# EAGLE design XBee7 (EAGLE 6.4)
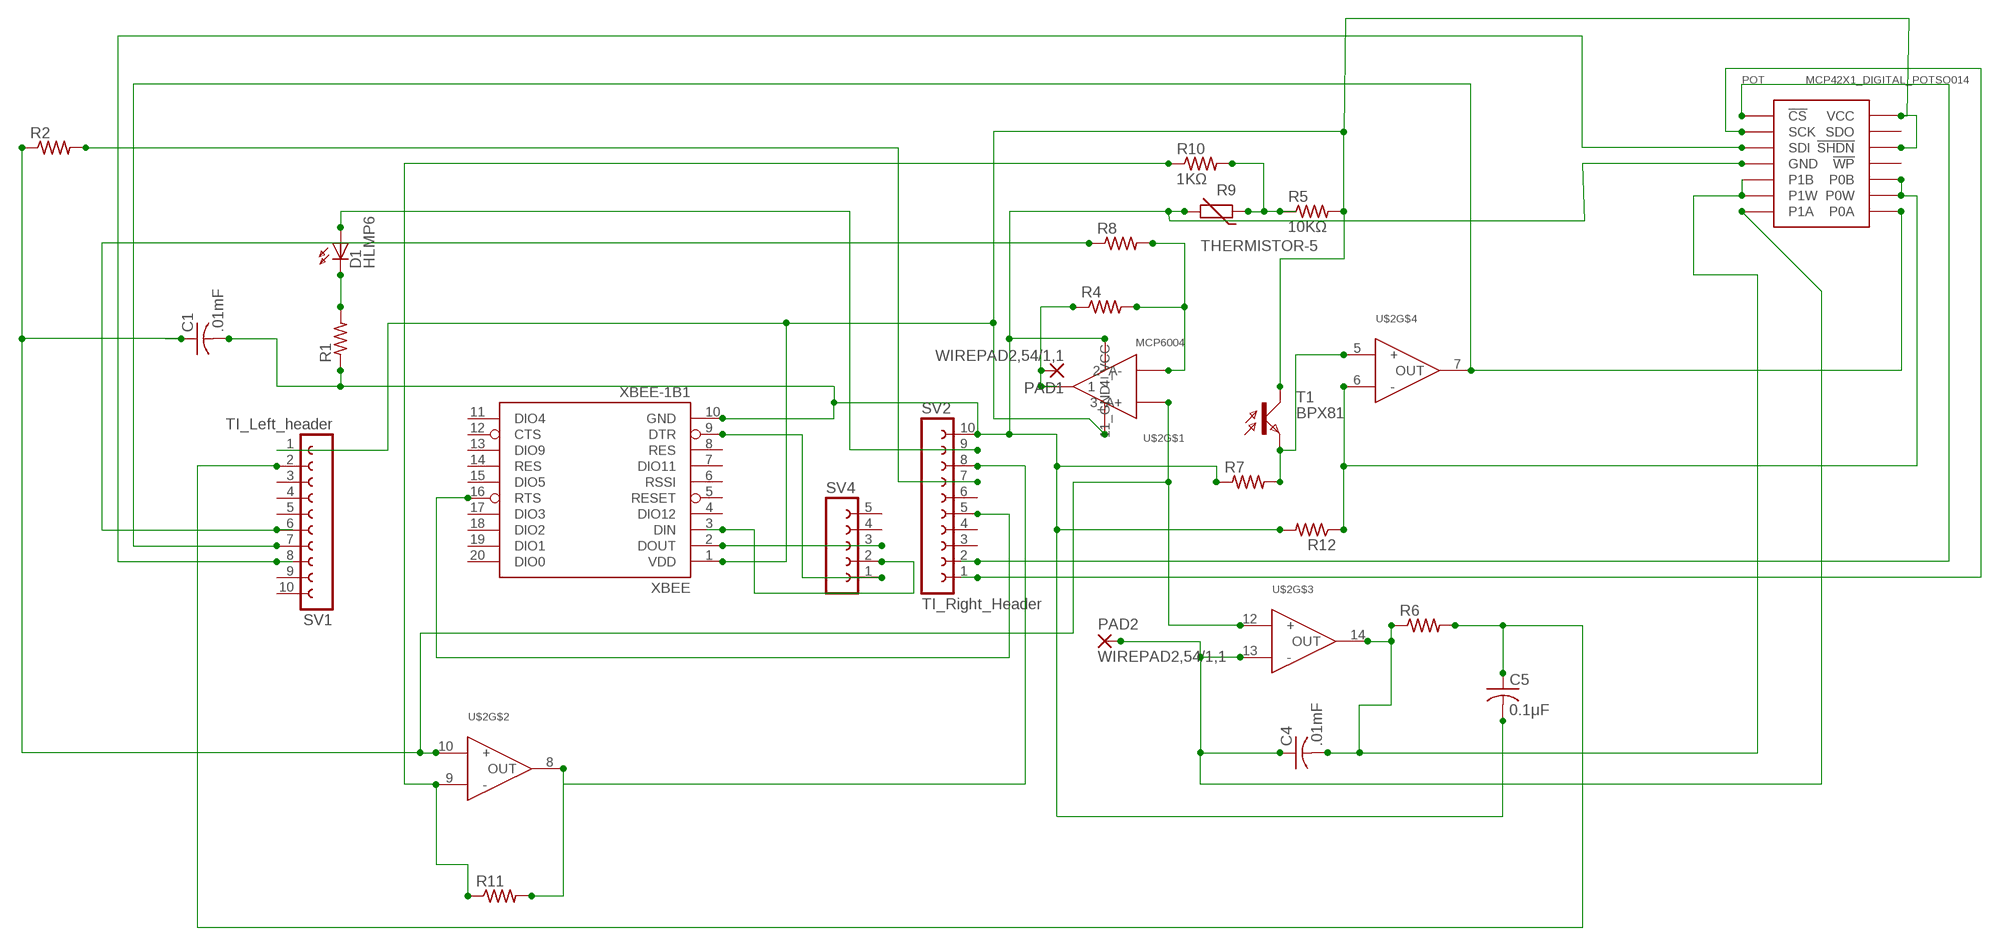
[diagram p0: schematic, sheet 1]

## Parts
C1  .01mF  C-USC0603  [C0603]
C4  .01mF  C-USC0603  [C0603]
C5  0.1μF  C-USC0603  [C0603]
D1  HLMP6  [HLMP6]
PAD1  WIREPAD2,54/1,1  [2,54/1,1]
PAD2  WIREPAD2,54/1,1  [2,54/1,1]
POT  MCP42X1_DIGITAL_POTSO014  [SO014]
R1  R-US_R0603  [R0603]
R2  R-US_R0603  [R0603]
R4  R-US_R0603  [R0603]
R5  10KΩ  R-US_R0603  [R0603]
R6  R-US_R0603  [R0603]
R7  R-US_R0603  [R0603]
R8  R-US_R0603  [R0603]
R9  THERMISTOR-5  [R-5]
R10  1KΩ  R-US_R0603  [R0603]
R11  R-US_R0603  [R0603]
R12  R-US_R0603  [R0603]
SV1  TI_Left_header  FE10-1  [FE10]
SV2  TI_Right_Header  FE10-1  [FE10]
SV4  FE05-1  [FE05-1]
T1  BPX81  [BPX81]
U$2  MCP6004  [SO014]
XBEE  XBEE-1B1  [XBEE-1]

## Nets
GND: C1.2 C5.2 POT.P4(GND) R1.1 R7.1 R9.2 R12.2 SV2.10 U$2.11(11_GND) XBEE.10(GND)
N$1: D1.K R1.2
N$2: R7.2 T1.E U$2.5(+)
N$3: SV4.3 XBEE.2(DOUT)
N$4: SV4.1 XBEE.9(DTR)
N$5: SV4.2 XBEE.3(DIN)
N$6: R2.2 SV2.7
N$7: POT.P9(P0W) POT.P10(P0B) R12.1 U$2.6(-)
N$8: R11.2 SV2.8 U$2.8(OUT)
N$13: R10.1 R11.1 U$2.9(-)
N$14: PAD1.1(P) R4.1 U$2.1
N$15: D1.A SV2.9
N$17: C4.1 PAD2.1(P) POT.P7(P1A) U$2.13(-)
N$18: C4.2 POT.P5(P1B) POT.P6(P1W) R6.1 U$2.14(OUT)
N$19: C5.1 R6.2 SV1.2
N$20: R5.1 R9.1 R10.2
N$21: R4.2 R8.2 U$2.2(2_A-)
N$22: SV2.5 XBEE.16(RTS)
POT_CS: POT.P1(!CS) SV2.2
POT_SCK: POT.P2(SCK) SV2.1
POT_SDI: POT.P3(SDI) SV1.8
PULSE: R8.1 SV1.6
PWM-VCC/2: C1.1 R2.1 U$2.3(3_A+) U$2.10(+) U$2.12(+)
TI_PN7_READ: POT.P8(P0A) SV1.7 U$2.7(OUT)
VCC: POT.P12(!SHDN) POT.P14(VCC) R5.2 SV1.1 T1.C U$2.4(4_VCC) XBEE.1(VDD)
Unconnected: POT.P11(!WP) POT.P13(SDO) SV1.3 SV1.4 SV1.5 SV1.9 SV1.10 SV2.3 SV2.4 SV2.6 SV4.4 SV4.5 XBEE.4(DIO12) XBEE.5(RESET) XBEE.6(RSSI) XBEE.7(DIO11) XBEE.8(RES) XBEE.11(DIO4) XBEE.12(CTS) XBEE.13(DIO9) XBEE.14(RES) XBEE.15(DIO5) XBEE.17(DIO3) XBEE.18(DIO2) XBEE.19(DIO1) XBEE.20(DIO0)

## Library data of the parts
C1 C4 C5 = rcl:C-US: CAPACITOR, American symbol
D1 = display-hp:HLMP6: LED 2mm horizontal; MF: AGILENT TECHNOLOGIES; MPN: HLMP-6500; OC_FARNELL: 1652490; OC_NEWARK: 40K0088
PAD1 PAD2 = wirepad:WIREPAD: Wire PAD connect wire on PCB
POT = JackLibrary:MCP42X1_DIGITAL_POT
R1 R2 R4-R8 R10-R12 = resistor:R-US_: RESISTOR, American symbol
R9 = varistor:THERMISTOR: THERMISTOR
SV1 SV2 = con-lsta:FE10-1: FEMALE HEADER; OC_FARNELL: unknown; OC_NEWARK: unknown
SV4 = con-lsta:FE05-1: FEMALE HEADER; OC_FARNELL: unknown; OC_NEWARK: unknown
T1 = opto-trans-siemens:BPX81: PHOTO TRANSISTOR; OC_FARNELL: unknown; OC_NEWARK: unknown
U$2 = SparkFun-AnalogIC:MCP6004: 14SOIC quad op amp, R2R, low power
XBEE = SparkFun-RF:XBEE-1: Xbee module footprints SMT header is CONN-09042.

## Board
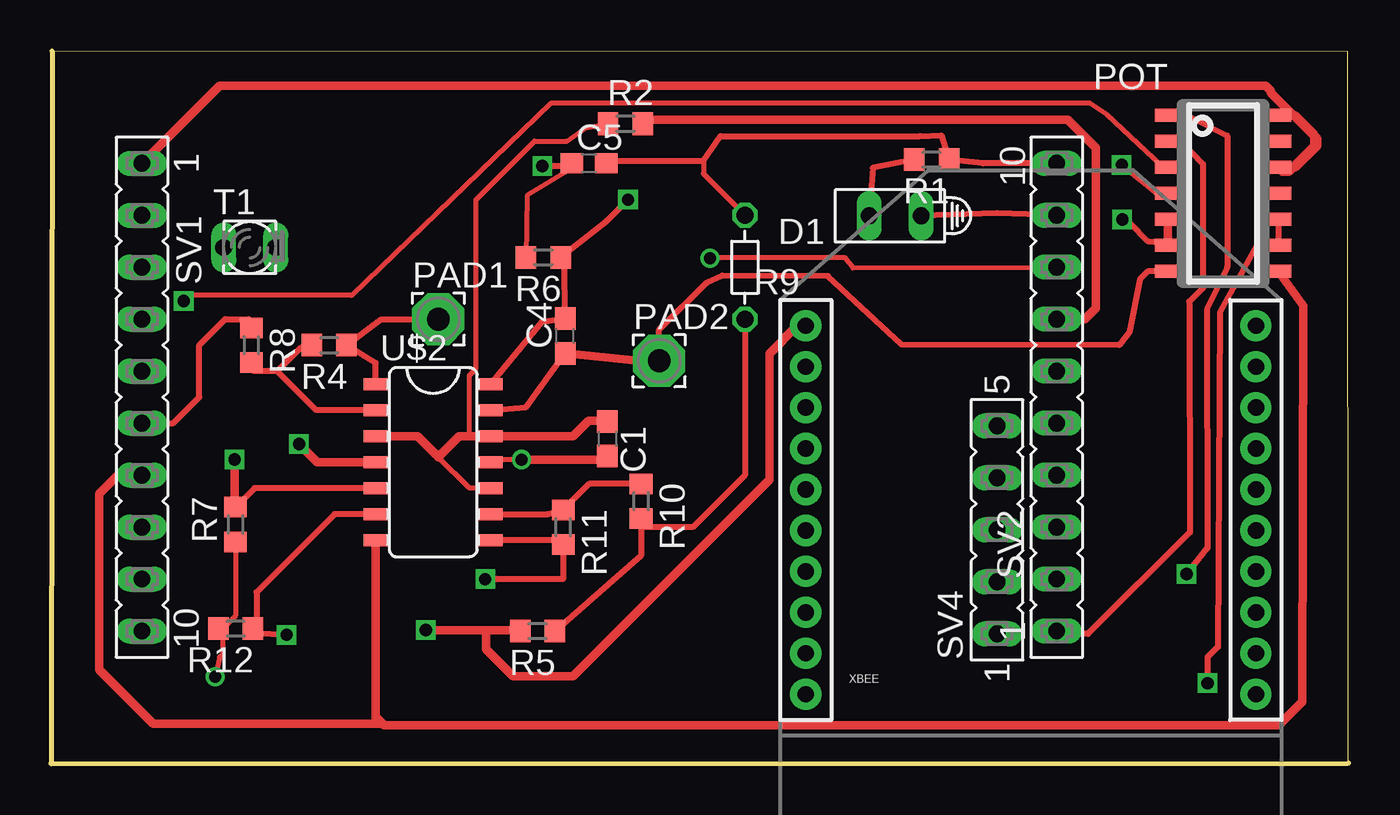
[diagram p1: board, top side]
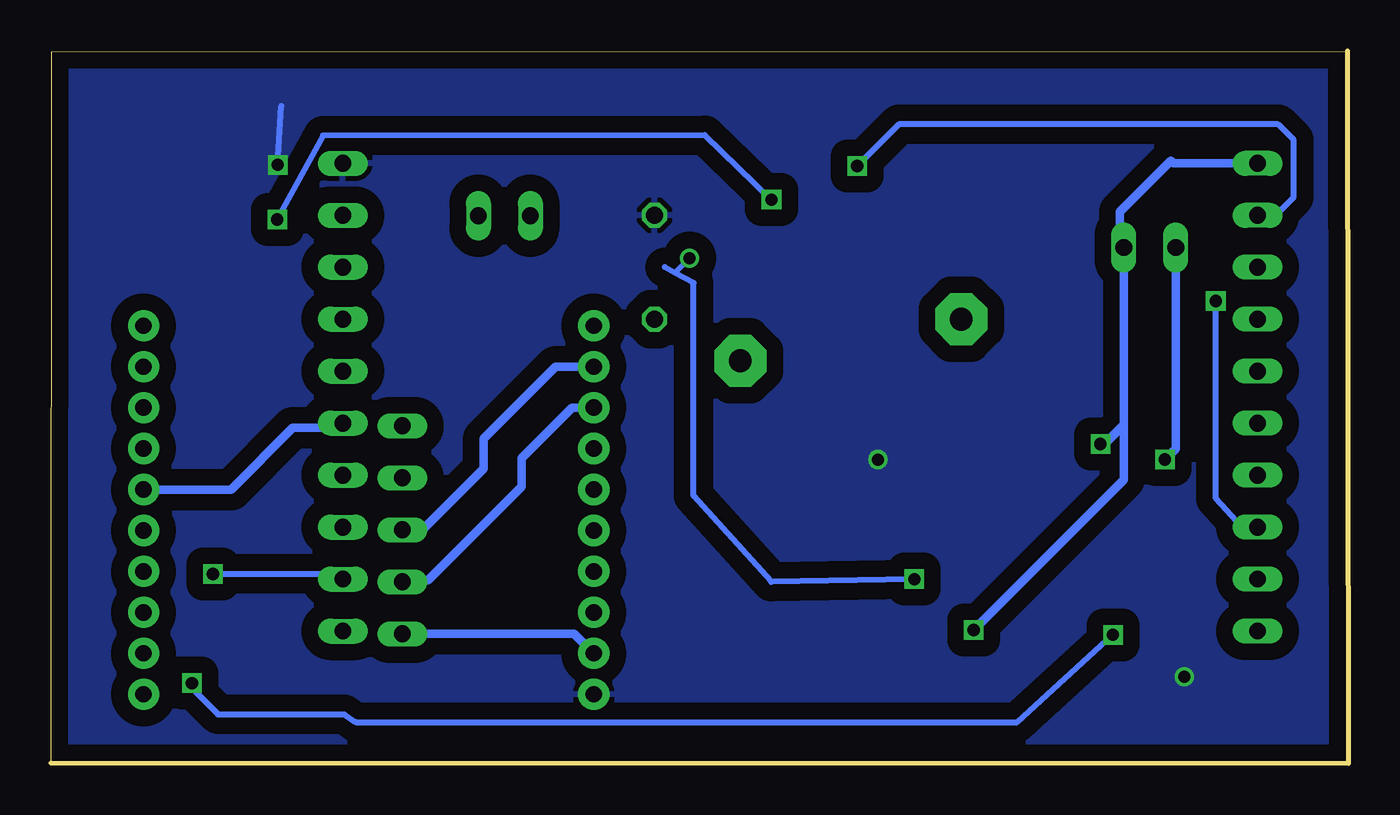
[diagram p2: board, bottom side, seen from below]

Size 63.4 x 34.81 mm. Coordinates in mm from the lower left corner, seen from the top.
Outline: 63.4,0.03 63.37,34.79 0.05,34.81 0,0 63.4,0.03
Copper layers (1*16): Top 0.0356mm / dielectric 1.5011mm / Bottom 0.0356mm
Design rules "LaenPCBOrder": minimum track width 6mil, minimum drill 13mil, track to track 6mil, track to pad 6mil, pad to pad 6mil, via to via 6mil, smd to smd 6mil, copper to edge 15mil, drill to drill 6mil, minimum pad ring 7mil, minimum via ring 7mil, stop-mask expansion 3mil, vias tented up to drill 0mil, thermal gap 10mil

### Footprints (pad centres in the part's own frame; a part is rotated, then mirrored left to right if it is on the bottom)
C0603 = smd 1.1 x 1: 1 -0.85,0; 2 0.85,0
HLMP6 = drill 0.813 long: A -1.27,0; K 1.27,0
2,54/1,1 = drill 1.118 pad 2.54 octagon: 1 0,0
SO014 = smd 1.27 x 0.635: P1 -2.692,3.81; P2 -2.692,2.54; P3 -2.692,1.27; P4 -2.692,0; P5 -2.692,-1.27; P6 -2.692,-2.54; P7 -2.692,-3.81; P8 2.692,-3.81; P9 2.692,-2.54; P10 2.692,-1.27; P11 2.692,0; P12 2.692,1.27; P13 2.692,2.54; P14 2.692,3.81
R0603 = smd 1 x 1.1: 1 -0.85,0; 2 0.85,0
R-5 = drill 0.813 octagon: 1 -2.54,0; 2 2.54,0
FE10 = drill 0.813 long: 1 -11.43,0; 2 -8.89,0; 3 -6.35,0; 4 -3.81,0; 5 -1.27,0; 6 1.27,0; 7 3.81,0; 8 6.35,0; 9 8.89,0; 10 11.43,0
FE05-1 = drill 0.813 long: 1 -5.08,0; 2 -2.54,0; 3 0,0; 4 2.54,0; 5 5.08,0
BPX81 = drill 0.813 long: C 1.27,0; E -1.27,0
SO014' = smd 0.6 x 1.2: 1 -3.175,-2.8; 2 -1.905,-2.8; 3 -0.635,-2.8; 4 0.635,-2.8; 5 1.905,-2.8; 6 3.175,-2.8; 7 4.445,-2.8; 8 4.445,2.8; 9 3.175,2.8; 10 1.905,2.8; 11 0.635,2.8; 12 -0.635,2.8; 13 -1.905,2.8; 14 -3.175,2.8
XBEE-1 = drill 0.8 pad 1.524: 1 -11,20; 2 -11,18; 3 -11,16; 4 -11,14; 5 -11,12; 6 -11,10; 7 -11,8; 8 -11,6; 9 -11,4; 10 -11,2; 11 11,2; 12 11,4; 13 11,6; 14 11,8; 15 11,10; 16 11,12; 17 11,14; 18 11,16; 19 11,18; 20 11,20

### Placement (x,y rotation side)
C1  27.18,15.88 270 top
C4  25.12,20.9 90 top
C5  26.29,29.34 0 top
D1  41.25,26.77 180 top
PAD1  18.92,21.72 0 top
PAD2  29.72,19.68 0 top
POT  57.28,27.86 0 top
R1  43.03,29.51 180 top
R2  28.07,31.27 0 top
R4  13.59,20.45 180 top
R5  23.77,6.48 180 top
R6  24.05,24.74 180 top
R7  9.02,11.68 90 top
R8  9.78,20.45 270 top
R9  33.91,24.26 90 top
R10  28.83,12.83 270 top
R11  25.02,11.56 270 top
R12  9.02,6.6 180 top
SV1  4.45,17.91 270 top
SV2  49.15,17.91 90 top
SV4  46.23,11.43 90 top
T1  9.7,25.22 0 top
U$2  MCP6004  [SO014']  18.67,15.37 270 top
XBEE  47.88,1.4 0 top

### Tracks (layer width: path | path; a pad name or v marks a point on that pad's centre or on a via)
GND  (via drill 0.58, 0.6)
  Top 0.254: 54.53,27.74 POT.P4 | 49.23,29.34 SV2.10 | R9.2 31.88,28.83 31.88,29.46 | U$2.11 21.72,14.86 v22.99,14.86 | C5.2 27.43,29.46 27.56,29.46 | 8.38,6.6 9.02,7.24 R7.1 | v8.01,4.25 8.23,5.21 8.38,5.33 8.38,6.6 | 8.38,6.6 R12.2
  Top 0.305: SV2.10 45.55,29.34 R1.1 43.51,30.7 42.47,30.66 32.71,30.66 31.88,29.46 27.56,29.46 | 54.53,27.74 54.23,27.74 v52.32,29.26
  Top 0.406: v22.99,14.86 27.01,14.86 C1.2
  Bottom 0.305: v52.32,29.26 52.15,32.13
  pour Bottom (isolate 0.813): 0.61,1.02 0.71,34.16 63.2,33.99 63.12,0.58
N$1
  Top 0.305: R1.2 40.16,29.11 D1.K
N$2  (via drill 0.6)
  Top 0.305: U$2.5 9.95,13.46 R7.2
  Top 0.406: v8.97,14.86 8.97,12.59 R7.2
  Bottom 0.406: T1.E 8.43,15.39 v8.97,14.86
N$3
  Bottom 0.406: XBEE.2 38.74,19.4 42.27,15.88 42.27,14.4 45.31,11.35 46.15,11.35 SV4.3
N$4
  Bottom 0.406: SV4.1 37.83,6.35 XBEE.9
N$5
  Bottom 0.406: XBEE.3 37.95,17.4 40.41,14.93 40.41,13.54 44.98,8.97 46.15,8.97 SV4.2
N$6
  Top 0.406: SV2.7 50.52,21.72 51.05,22.25 51.05,30.1 49.68,31.47 29.12,31.47 R2.2
N$7  (via drill 0.6)
  Top 0.305: U$2.6 13.84,12.19 10.03,8.38 10.03,6.77 R12.1 9.94,6.35 v11.51,6.3 | POT.P10 POT.P9 58.93,25.32 57.12,22.05 57.02,5.72 56.51,5.21 v56.51,3.94
  Bottom 0.305: v11.51,6.3 16.18,2.03 48.51,2.03 49.07,2.41 55.24,2.41 56.51,3.68 v56.51,3.94
N$8  (via drill 0.58, 0.6)
  Top 0.254: v32.19,24.7 32.32,24.74 38.77,24.74 39.18,24.23 49.02,24.26 SV2.8
  Top 0.305: U$2.8 24.9,10.92 R11.2 25.02,9.01 v21.21,9.02
  Bottom 0.254: v32.19,24.7 32.83,24.07 32.88,23.97
  Bottom 0.305: v21.21,9.02 28.19,8.89 32,13.08 32,23.5 32.88,23.97 33.4,24.26
N$13
  Top 0.305: U$2.9 24.25,12.19 R11.1 26.29,13.68 R10.1
N$14
  Top 0.305: U$2.1 15.87,19.57 R4.1 16.13,21.71 PAD1.1
N$15
  Top 0.305: SV2.9 46.23,26.9 D1.A
N$17
  Top 0.305: U$2.13 23.2,17.42 C4.1 | POT.P7 53.59,24.05 53.21,23.67 52.71,21.08 52.2,20.45 41.58,20.47 37.97,23.82 32.79,23.85 32.03,23.5 29.72,21.21 PAD2.1
  Top 0.406: C4.1 29.63,19.6 PAD2.1
N$18  (via drill 0.6)
  Top 0.305: U$2.14 23.99,21.59 C4.2 25.09,24.52 R6.1 27.14,26.5 v28.19,27.56 | v52.35,26.59 52.71,26.47 53.59,25.53 54.46,25.45 POT.P6
  Top 0.406: POT.P5 POT.P6
  Bottom 0.305: v28.19,27.56 31.45,30.71 50.11,30.68 v52.35,26.59
N$19  (via drill 0.6)
  Top 0.254: R6.2 23.27,27.76 25.53,29.15 C5.1
  Top 0.305: v24,29.21 25.31,29.21 C5.1
  Bottom 0.305: SV1.2 3.56,26.8 2.67,27.69 2.67,30.48 3.43,31.24 21.97,31.24 v24,29.21
N$20
  Top 0.305: R9.1 33.91,14.1 31.37,11.56 28.96,11.56 R10.2 28.83,10.16 R5.1
N$21
  Top 0.305: U$2.2 12.95,17.27 11.05,19.18 | 11.05,19.18 9.91,19.18 R8.2 | R4.2 12.19,20.32 11.05,19.18
N$22
  Bottom 0.406: XBEE.16 54.6,13.4 51.59,16.41 49.38,16.41 SV2.5
POT_CS  (via drill 0.6)
  Top 0.305: POT.P1 55.5,31.67 57.48,30.68 57.48,24.26 56.49,22.2 56.51,10.54 v55.5,9.27
  Bottom 0.305: v55.5,9.27 49.4,9.27 SV2.2
POT_SCK
  Top 0.305: POT.P2 55.24,30.4 56.29,29.31 56.29,23.24 55.63,22.58 55.65,11.3 50.67,6.35 49.28,6.35 SV2.1
POT_SDI  (via drill 0.6)
  Top 0.254: POT.P3 54.28,29.21 51.59,31.73 50.75,32.28 24.44,32.28 14.68,22.88 6.76,22.88
  Top 0.305: 6.76,22.88 v6.48,22.61
  Bottom 0.305: SV1.8 5.21,11.56 6.48,12.95 v6.48,22.61
PULSE
  Top 0.305: SV1.6 5.97,16.64 7.24,17.91 7.24,20.45 8.51,21.72 9.65,21.72 R8.1
PWM-VCC/2
  Top 0.254: U$2.10 20.45,13.46 18.92,14.99 18.8,15.11 18.54,15.37 | 20.45,16 20.45,18.99 20.76,19.3 20.76,27.56 23.62,30.42 25.21,30.42 26.15,31.08 R2.1
  Top 0.406: 18.92,14.99 19.94,16 20.45,16 U$2.12 25.5,16 26.26,16.76 27.14,16.76 C1.1 | U$2.3 17.91,16 18.8,15.11
TI_PN7_READ
  Top 0.406: U$2.7 15.87,2.29 | 15.87,2.29 15.87,2.19 16.1,1.96 4.98,1.96 2.34,4.6 2.34,13.18 3.38,14.22 4.32,14.22 SV1.7 | POT.P8 61.19,22.38 61.14,3.02 59.99,1.88 16.27,1.88 15.87,2.29
VCC  (via drill 0.6)
  Top 0.406: v18.31,6.53 21.26,6.53 | 21.26,6.53 22.87,6.53 R5.2 | U$2.4 13,14.73 v12.12,15.62 | POT.P14 60.78,31.67 61.72,30.73 61.72,30.17 60.48,28.93 60.17,28.93 POT.P12 60.81,29.13 61.87,30.2 61.87,30.53 59.61,32.79 59.61,32.87 59.36,33.12 8.23,33.12 SV1.1 | XBEE.1 36.46,21.4 35.1,20.04 35.1,13.87 25.5,4.27 22.58,4.27 21.26,5.59 21.26,6.53
  Bottom 0.406: 10.97,16.56 T1.C 11.18,25.43 11.18,26.97 8.69,29.46 8.56,29.34 SV1.1 | 10.97,16.56 10.97,13.87 v18.31,6.53 | v12.12,15.62 11.91,15.62 10.97,16.56